# EAGLE design Teeces PSI (EAGLE 9.5.1)
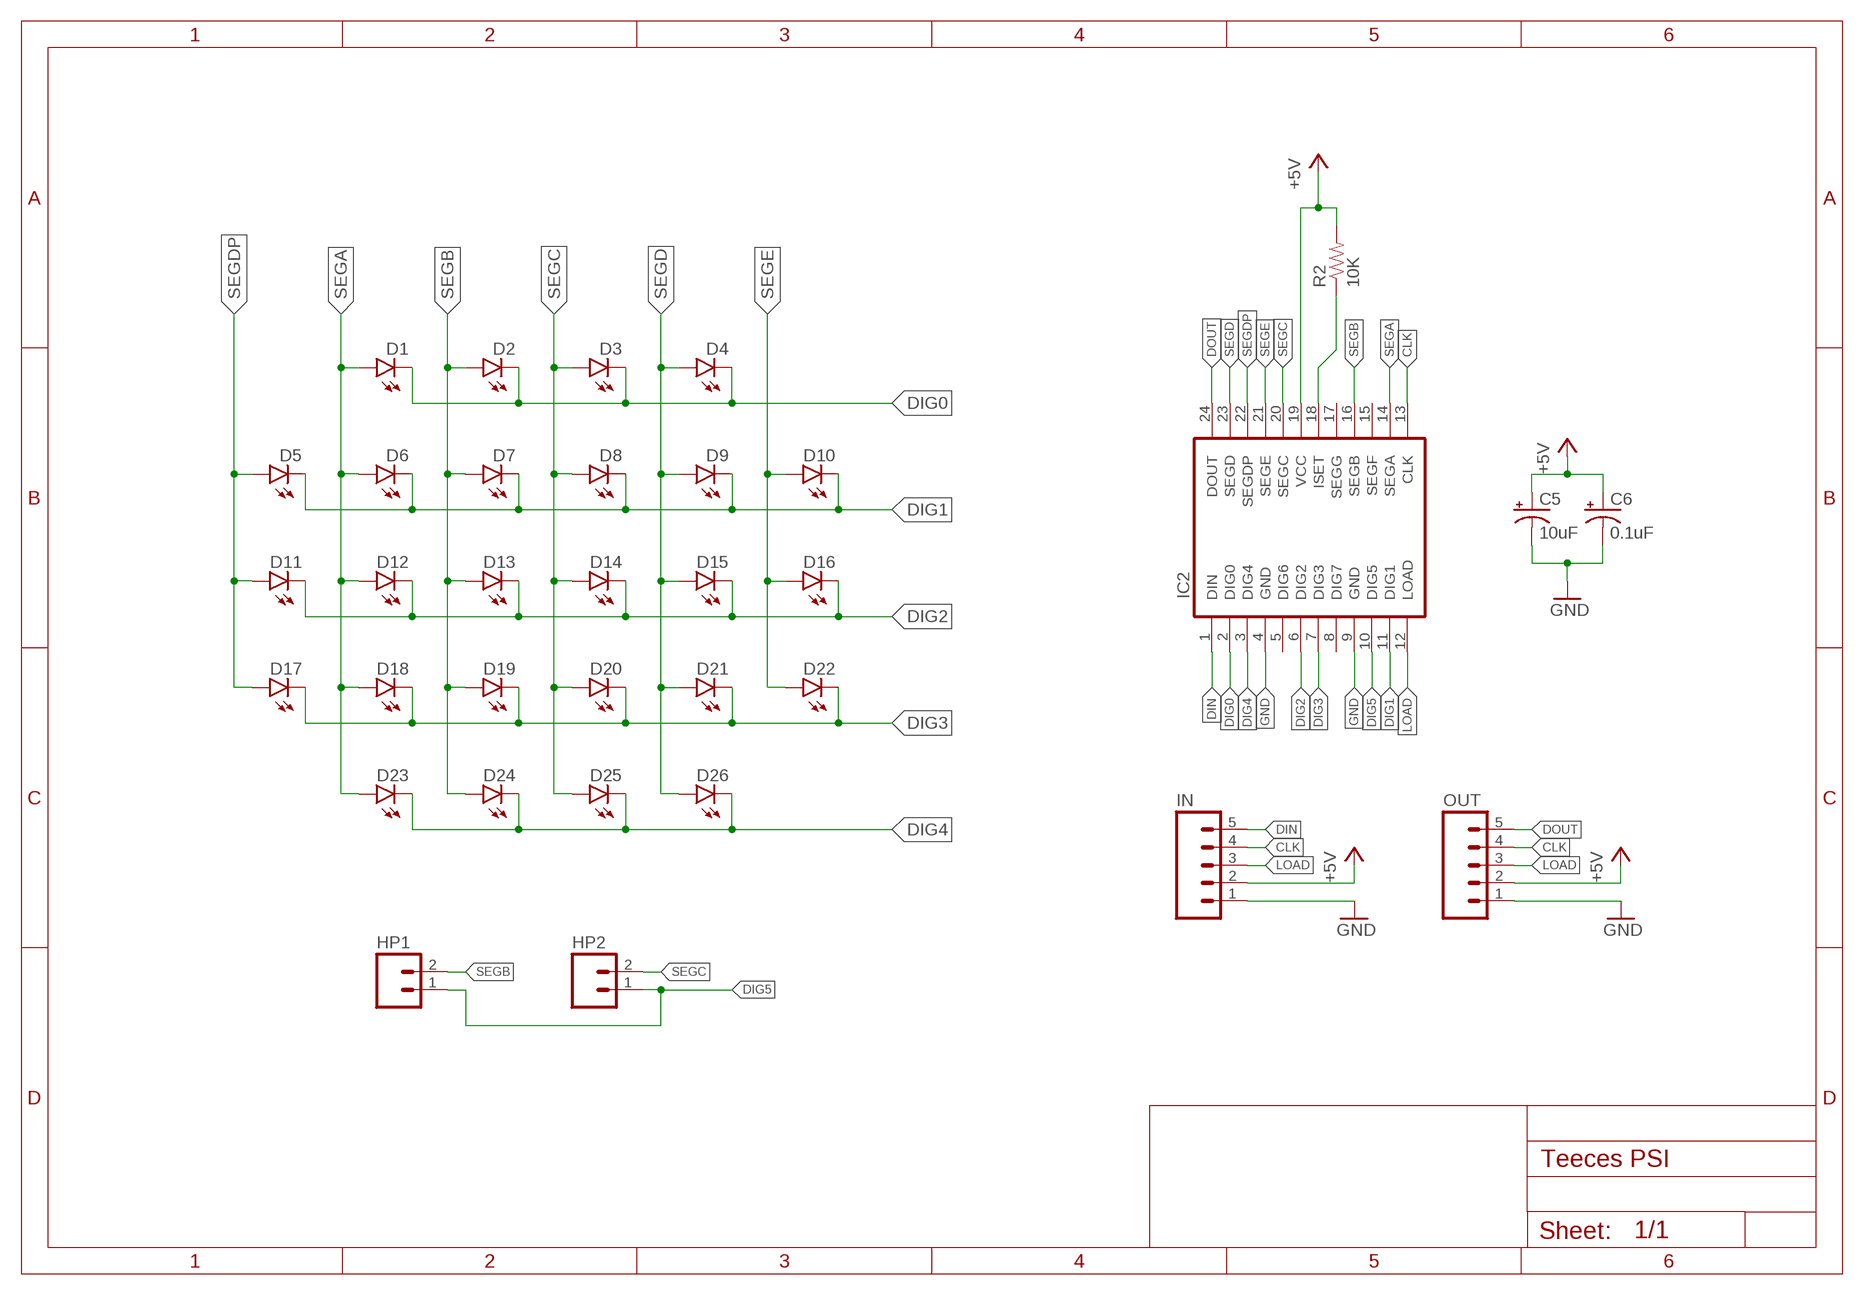
[diagram p0: schematic, sheet 1]

## Parts
C5  10uF  CPOL-USE2.5-5  [E2,5-5]
C6  0.1uF  CPOL-USE2.5-5  [E2,5-5]
D1  LED5MM  [LED5MM_SLIM]
D2  LED5MM  [LED5MM_SLIM]
D3  LED5MM  [LED5MM_SLIM]
D4  LED5MM  [LED5MM_SLIM]
D5  LED5MM  [LED5MM_SLIM]
D6  LED5MM  [LED5MM_SLIM]
D7  LED5MM  [LED5MM_SLIM]
D8  LED5MM  [LED5MM_SLIM]
D9  LED5MM  [LED5MM_SLIM]
D10  LED5MM  [LED5MM_SLIM]
D11  LED5MM  [LED5MM_SLIM]
D12  LED5MM  [LED5MM_SLIM]
D13  LED5MM  [LED5MM_SLIM]
D14  LED5MM  [LED5MM_SLIM]
D15  LED5MM  [LED5MM_SLIM]
D16  LED5MM  [LED5MM_SLIM]
D17  LED5MM  [LED5MM_SLIM]
D18  LED5MM  [LED5MM_SLIM]
D19  LED5MM  [LED5MM_SLIM]
D20  LED5MM  [LED5MM_SLIM]
D21  LED5MM  [LED5MM_SLIM]
D22  LED5MM  [LED5MM_SLIM]
D23  LED5MM  [LED5MM_SLIM]
D24  LED5MM  [LED5MM_SLIM]
D25  LED5MM  [LED5MM_SLIM]
D26  LED5MM  [LED5MM_SLIM]
HP1  M02SQ  [1X02-SQ]
HP2  M02SQ  [1X02-SQ]
IC2  MAX7219CNG  MAX7219CNGROUNDPADS  [DIP24-3]
IN  CONN_05  [1X05]
OUT  CONN_05  [1X05]
R2  10K  RESISTORAXIAL-0.3  [AXIAL-0.3]

## Nets
+5V [power]: C5.+ C6.+ IC2.19(VCC) IN.2 OUT.2 R2.P$2
CLK: IC2.13(CLK) IN.4 OUT.4
DIG0: D1.K(C) D2.K(C) D3.K(C) D4.K(C) IC2.2(DIG0)
DIG1: D5.K(C) D6.K(C) D7.K(C) D8.K(C) D9.K(C) D10.K(C) IC2.11(DIG1)
DIG2: D11.K(C) D12.K(C) D13.K(C) D14.K(C) D15.K(C) D16.K(C) IC2.6(DIG2)
DIG3: D17.K(C) D18.K(C) D19.K(C) D20.K(C) D21.K(C) D22.K(C) IC2.7(DIG3)
DIG4: D23.K(C) D24.K(C) D25.K(C) D26.K(C) IC2.3(DIG4)
DIG5: HP1.1 HP2.1 IC2.10(DIG5)
DIN: IC2.1(DIN) IN.5
DOUT: IC2.24(DOUT) OUT.5
GND [power]: C5.- C6.- IC2.4(GND) IC2.9(GND) IN.1 OUT.1
LOAD: IC2.12(LOAD) IN.3 OUT.3
N$19: IC2.18(ISET) R2.P$1
SEGA: D1.A D6.A D12.A D18.A D23.A IC2.14(SEGA)
SEGB: D2.A D7.A D13.A D19.A D24.A HP1.2 IC2.16(SEGB)
SEGC: D3.A D8.A D14.A D20.A D25.A HP2.2 IC2.20(SEGC)
SEGD: D4.A D9.A D15.A D21.A D26.A IC2.23(SEGD)
SEGDP: D5.A D11.A D17.A IC2.22(SEGDP)
SEGE: D10.A D16.A D22.A IC2.21(SEGE)
Unconnected: IC2.5(DIG6) IC2.8(DIG7) IC2.15(SEGF) IC2.17(SEGG)

## Library data of the parts
C5 C6 = rseries:CPOL-US: POLARIZED CAPACITOR, American symbol
D1-D26 = rseries:LED: LEDs Thru-hole 3mm and 5mm LEDs used on Teeces logic displays
HP1 HP2 = rseries:M02: Standard 2-pin 0.1" header. Use with - straight break away headers ( PRT-00116) - right angle break away headers (PRT-00553) - swiss pins (PRT-00743) - machine pins (PRT-00117) - female headers (PRT-00115) Molex polarized connector foot print use with: PRT-08233 with associated crimp pins and housings. 2.54_SCREWTERM for use with PRT-10571. 3.5mm Screw Terminal footprints for PRT-08084 5mm Screw Terminal footprints for use with PRT-08432
IC2 = rseries:MAX7219CNG: LED DISPLAY DRIVER
IN OUT = rseries:CONN_05: Multi connection point. Often used as Generic Header-pin footprint for 0.1 inch spaced/style header connections On any of the 0.1 inch spaced packages, you can populate with these: Break Away Headers - Straight <https://www.sparkfun.com/products/116> (PRT-00116) Break Away Male Headers - Right Angle <https://www.sparkfun.com/products/553> (PRT-00553) Female Headers <https://www.sparkfun.com/products/115> (PRT-00115) Break Away Headers - Machine Pin <https://www.sparkfun.com/products/117> (PRT-00117) Break Away Female Headers - Swiss Machine Pin <https://www.sparkfun.com/products/743> (PRT-00743) For SCREWTERMINALS and SPRING TERMINALS visit here: Screw Terimnals on SparkFun.com <https://www.sparkfun.com/search/results?term=Screw+Terminals> (5mm/3.5mm/2.54mm spacing) This device is also useful as a general connection point to wire up your design to another part of your project. Our various solder wires solder well into these plated through hole pads. Hook-Up Wire - Assortment (Stranded, 22 AWG) <https://www.sparkfun.com/products/11375> (PRT-11375) Hook-Up Wire - Assortment (Solid Core, 22 AWG) <https://www.sparkfun.com/products/11367> (PRT-11367) View the entire wire category on our website here <https://www.sparkfun.com/categories/141> Special notes: Molex polarized connector foot print use with SKU : PRT-08231 with associated crimp pins and housings. 1MM SMD Version SKU: PRT-10208
R2 = SparkFun-Resistors:RESISTOR: Resistor Basic schematic elements and footprints for 0603, 1206, and PTH resistors.

## Net classes
0 default: width 0.254 mm, drill 0.254 mm, clearance 0.076 mm
1 power: width 0.508 mm, clearance 0.076 mm

## Board
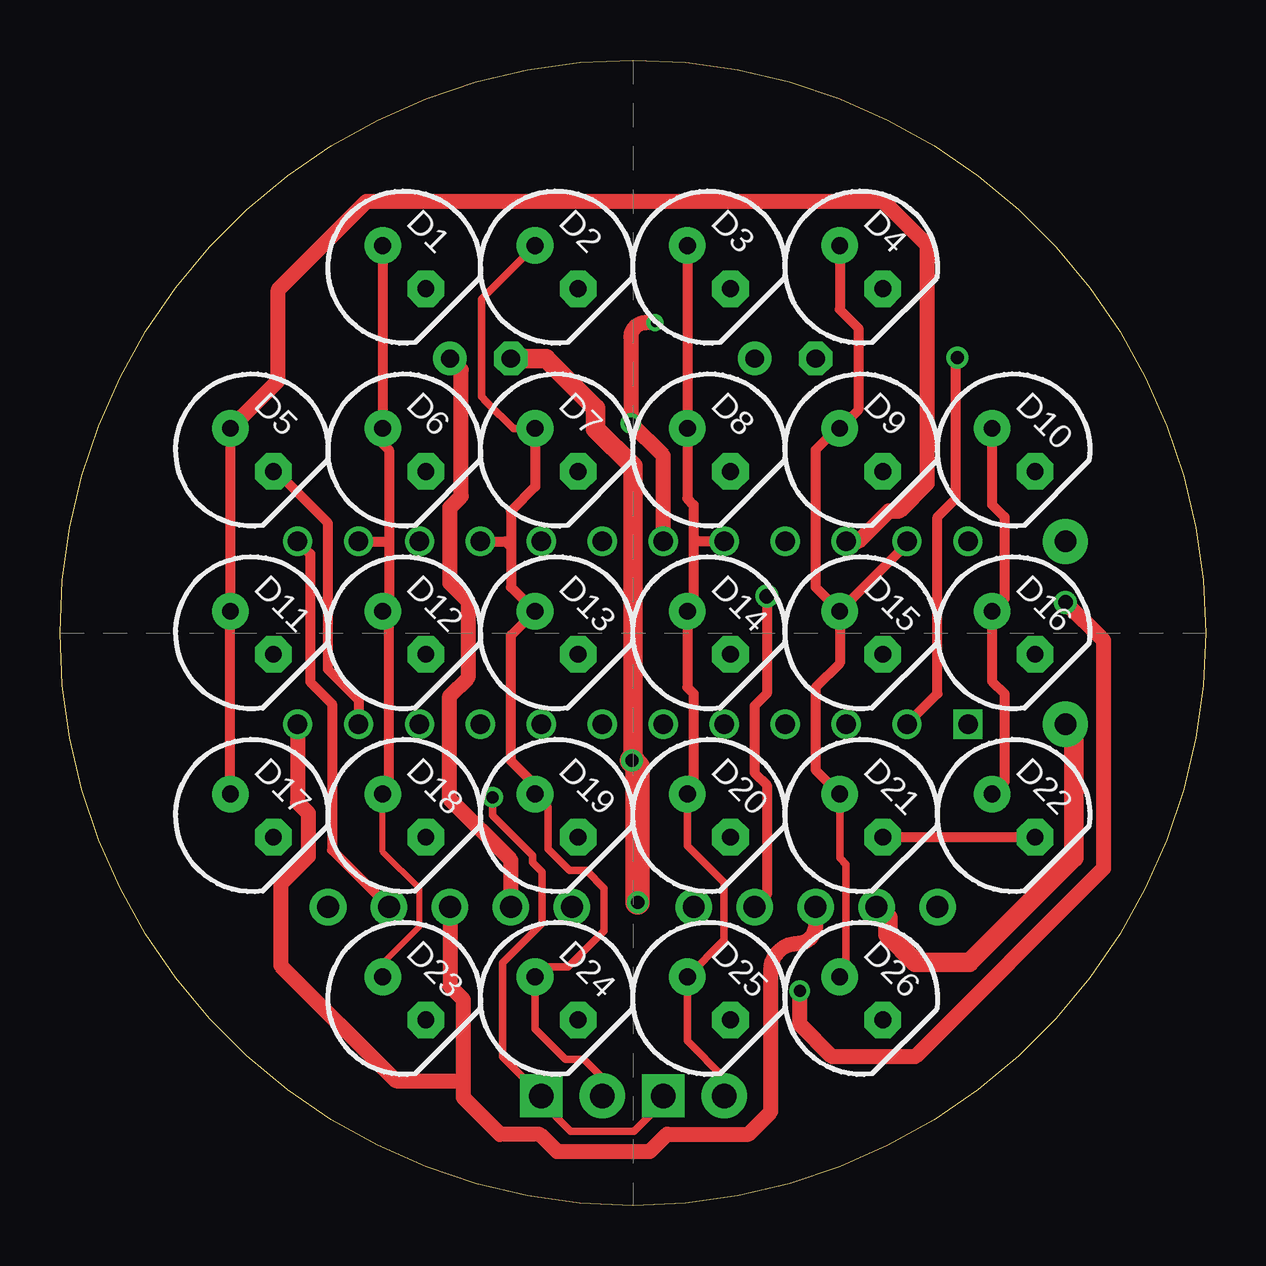
[diagram p1: board, top side]
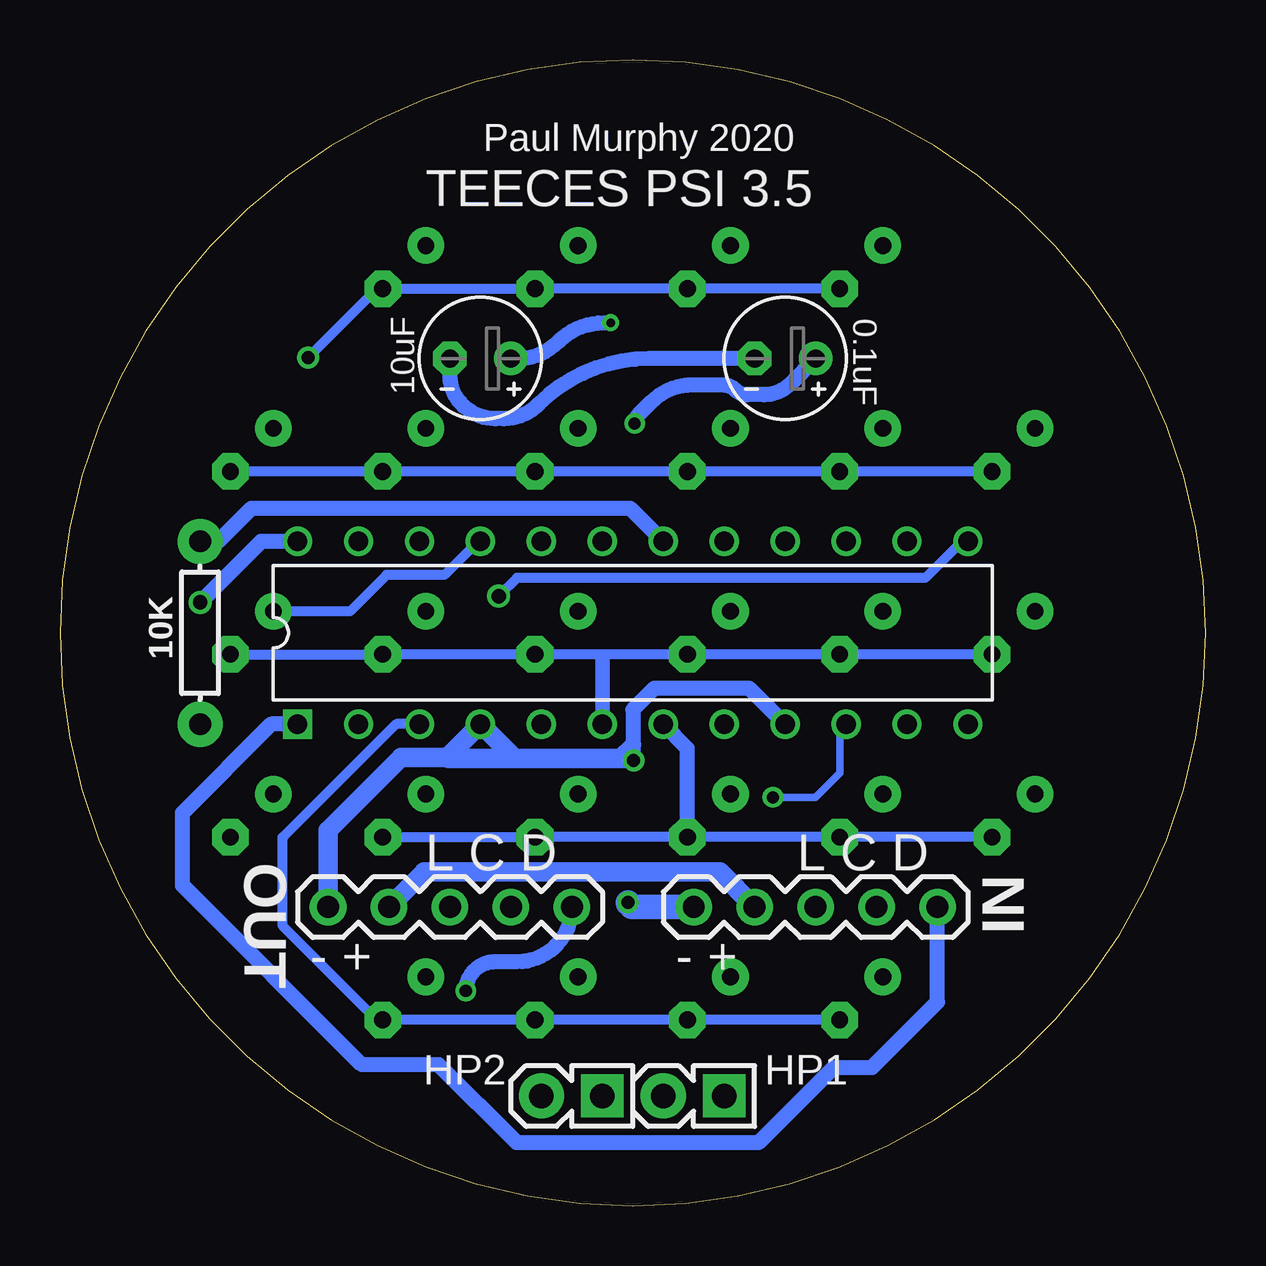
[diagram p2: board, bottom side, seen from below]

Size 47.75 x 47.75 mm. Coordinates in mm from the lower left corner, seen from the top.
Outline: 23.88,0 arc-90 0,23.88 arc-90 23.88,47.75 arc-90 47.75,23.88 arc-90 23.88,0
Copper layers (1*16): Top 0.0356mm / dielectric 1.5011mm / Bottom 0.0356mm
Design rules "LaenPCBOrder *": minimum track width 8mil, minimum drill 13mil, track to track 11mil, track to pad 11mil, pad to pad 6mil, via to via 6mil, smd to smd 6mil, copper to edge 15mil, drill to drill 6mil, minimum pad ring 7mil, minimum via ring 7mil, stop-mask expansion 3mil, vias tented up to drill 25mil, thermal gap 10mil

### Footprints (pad centres in the part's own frame; a part is rotated, then mirrored left to right if it is on the bottom)
E2,5-5 = drill 0.762 pad 1.397: + -1.27,0 | drill 0.762 pad 1.397 octagon: - 1.27,0
LED5MM_SLIM = drill 0.7 pad 1.524: A -1.27,0 | drill 0.7 pad 1.524 octagon: K 1.27,0
1X02-SQ = drill 1.016 pad 1.778 square: 1 0,0 | drill 1.016 pad 1.88: 2 2.54,0
DIP24-3 = drill 0.813 square: 1 -13.97,-3.81 | drill 0.813: 2 -11.43,-3.81; 3 -8.89,-3.81; 4 -6.35,-3.81; 5 -3.81,-3.81; 6 -1.27,-3.81; 7 1.27,-3.81; 8 3.81,-3.81; 9 6.35,-3.81; 10 8.89,-3.81; 11 11.43,-3.81; 12 13.97,-3.81; 13 13.97,3.81; 14 11.43,3.81; 15 8.89,3.81; 16 6.35,3.81; 17 3.81,3.81; 18 1.27,3.81; 19 -1.27,3.81; 20 -3.81,3.81; 21 -6.35,3.81; 22 -8.89,3.81; 23 -11.43,3.81; 24 -13.97,3.81
1X05 = drill 0.914 pad 1.524: 1 0,0; 2 2.54,0; 3 5.08,0; 4 7.62,0; 5 10.16,0
AXIAL-0.3 = drill 0.9 pad 1.88: P$1 -3.81,0; P$2 3.81,0

### Placement (x,y rotation side)
C5  30.23,35.31 180 bottom
C6  17.53,35.31 180 bottom
D1  14.35,39.12 315 top
D2  20.7,39.12 315 top
D3  27.05,39.12 315 top
D4  33.4,39.12 315 top
D5  8,31.5 315 top
D6  14.35,31.5 315 top
D7  20.7,31.5 315 top
D8  27.05,31.5 315 top
D9  33.4,31.5 315 top
D10  39.75,31.5 315 top
D11  8,23.88 315 top
D12  14.35,23.88 315 top
D13  20.7,23.88 315 top
D14  27.05,23.88 315 top
D15  33.4,23.88 315 top
D16  39.75,23.88 315 top
D17  8,16.26 315 top
D18  14.35,16.26 315 top
D19  20.7,16.26 315 top
D20  27.05,16.26 315 top
D21  33.4,16.26 315 top
D22  39.75,16.26 315 top
D23  14.35,8.64 315 top
D24  20.7,8.64 315 top
D25  27.05,8.64 315 top
D26  33.4,8.64 315 top
HP1  20.07,4.57 180 bottom
HP2  25.15,4.57 180 bottom
IC2  23.88,23.88 0 bottom
IN  21.34,12.45 0 bottom
OUT  36.58,12.45 0 bottom
R2  41.91,23.88 270 bottom

### Tracks (layer width: path | path; a pad name or v marks a point on that pad's centre or on a via)
+5V  (via drill 0.35 pad 0.65, 0.5)
  Top 0.635: v24.8,36.8 24.4,36.8 arc90 23.8,36.2 v23.8,32.6 25.15,31.25 IC2.19 | IN.2 18.8,14.4 16.24,16.96 16.24,21.24 17,22 17,25.2 16.26,25.94 16.26,29.1 16.72,29.56 16.72,34.84 C6.+
  Top 0.813: OUT.2 34.5,11.98 34.5,11.3 35.66,10.14 37.9,10.14 42.26,14.5 42.26,19.72 R2.P$2
  Bottom 0.635: C6.+ 17.31,34.25 arc45 18.4,33.8 19.12,33.8 arc45 19.6,34 arc-45 20.08,34.2 21.4,34.2 arc-45 23.11,33.49 23.66,32.94 arc-45 v23.8,32.6 | C5.+ 28.68,35.31 arc-45 27,36 arc45 25.07,36.8 v24.8,36.8
  Bottom 0.813: OUT.2 32.58,13.9 20.25,13.9 IN.2
CLK  (via drill 0.6)
  Top 0.406: v29.46,25.4 29.46,21.34 28.96,20.83 28.96,18.03 29.46,17.53 29.46,12.95 OUT.4 | IC2.13 10.43,27.16 10.43,21.83 11.34,20.92 11.34,14.82 IN.4
  Bottom 0.406: IC2.13 10.16,27.69 11.68,26.16 28.7,26.16 v29.46,25.4
DIG0  (via drill 0.55)
  Top 0.406: IC2.2 36.58,21.34 36.58,28.7 37.34,29.46 37.34,35.27 v37.41,35.34
  Bottom 0.406: D1.K D2.K D3.K D4.K 34.53,38.22 v37.41,35.34
DIG1
  Top 0.406: D5.K 9.03,30.6 11.18,28.45 11.18,22.35 12.45,21.08 IC2.11
  Bottom 0.406: D5.K D6.K D7.K D8.K D9.K D10.K
DIG2
  Bottom 0.406: D11.K D12.K D13.K 24.98,22.98 | 24.98,22.98 D14.K D15.K D16.K | 25.15,22.81 24.98,22.98
  Bottom 0.61: IC2.6 25.15,22.81
DIG3
  Top 0.406: D21.K D22.K
  Bottom 0.406: D17.K D18.K D19.K D20.K D21.K
  Bottom 0.635: D19.K 21.6,19.06 IC2.7
DIG4
  Bottom 0.406: D23.K D24.K D25.K D26.K 34.55,7.74 38.49,11.68 38.49,15.36 38.44,15.36 33.73,20.07 IC2.3
DIG5  (via drill 0.51)
  Top 0.305: HP2.1 25.15,4.32 23.92,3.09 21.29,3.09 20.07,4.32 HP1.1 18.44,6.19 18.44,10.11 20.1,11.77 20.1,13.9 19.7,14.3 19.7,14.6 18.03,16.27 v18.03,17.02
  Bottom 0.305: v18.03,17.02 16.26,17.02 15.24,18.03 15.24,19.81 IC2.10
DIN
  Bottom 0.635: IC2.1 38.95,20.07 42.64,16.38 42.64,13.34 35.17,5.87 31.97,5.87 28.73,2.63 18.62,2.63 15.49,5.76 13.9,5.76 11.18,8.48 IN.5
DOUT  (via drill 0.51, 0.6)
  Top 0.635: v41.91,25.15 43.49,23.57 43.49,14.05 35.65,6.21 32.18,6.21 30.84,7.55 v30.84,8.95
  Bottom 0.635: OUT.5 arc90 28.7,10.16 29.62,10.16 arc-90 v30.84,8.95 | IC2.24 39.37,27.69 v41.91,25.15
GND  (via drill 0.55 pad 0.65)
  Top 0.813: C6.- 20.26,35.31 22.33,33.24 22.33,32.36 23.88,30.82 23.88,18.51 24.08,18.31
  Top 1.016: v23.84,18.55 24.08,18.31 v24.08,12.64
  Bottom 0.635: C6.- 23.2,35.31 arc-45 27.8,33.4 arc45 29.25,32.8 29.6,32.8 arc45 30.97,33.37 31,33.4 arc45 31.5,34.6 C5.- | IC2.9 19.02,21.56 22.98,21.56 23.87,20.67 23.87,19.25 | 23.87,19.25 24.49,18.63 | 23.94,12.45 24.08,12.59 | 23.87,19.25 23.84,19.22 v23.84,18.55 23.92,18.63
  Bottom 0.813: 28.79,18.63 IC2.4 31.61,18.68 | 28.79,18.63 24.49,18.63 23.92,18.63 | 31.61,18.68 33.53,18.68 36.58,15.63 OUT.1 | 28.79,18.63 31.56,18.63 31.61,18.68
  Bottom 1.016: IN.1 23.94,12.45 | 24.08,12.59 v24.08,12.64
LOAD
  Top 0.635: IN.3 16.26,9.14 16.82,8.59 16.82,5.2 | OUT.3 31.5,11.68 arc-90 30.73,10.92 arc90 29.63,9.82 29.63,3.91 28.7,2.98 25.31,2.98 24.59,2.26 20.71,2.26 20,2.97 18.34,2.97 16.82,4.5 16.82,5.2 | IC2.12 9.91,16.8 10.35,16.36 10.35,14.55 9.2,13.4 9.2,10 14,5.2 16.82,5.2
N$19
  Bottom 0.635: IC2.18 23.98,29.06 39.78,29.06 41.15,27.69 R2.P$1
SEGA
  Top 0.254: D23.A 13.45,10.1 14.99,11.64 14.99,13.22 13.45,14.75 D18.A
  Top 0.406: 13.72,27.69 13.72,31.5 13.45,31.76 D6.A D1.A | 13.72,27.69 13.72,25.04 D12.A 13.69,24.53 13.69,17.39 D18.A | IC2.14 13.72,27.69
SEGB
  Top 0.305: HP1.2 22.61,5.33 21.84,6.1 21.08,6.1 19.8,7.38 D24.A 19.8,9.59 20.17,9.96 21.18,9.96 22.69,11.46 22.69,13.23 21.95,13.97 21.24,13.97 20.34,14.87 20.34,16.61 D19.A | D7.A 18.9,32.39 17.79,33.5 17.56,33.73 17.56,37.77 D2.A
  Top 0.406: D7.A 19.8,29.96 18.8,28.96 18.8,27.46 | 18.8,27.46 18.8,25.78 D13.A 18.8,23.77 18.8,18.54 19.8,17.54 D19.A | IC2.16 18.57,27.69 18.8,27.46
SEGC
  Top 0.305: D20.A 26.15,14.99 27.69,13.46 27.69,11.07 D25.A 26.15,6.87 27.69,5.33 HP2.2
  Top 0.406: D20.A 26.42,17.42 26.42,21.34 26.15,21.6 D14.A 26.42,25.04 26.42,27.86 | 26.42,27.86 26.42,29.21 26.15,29.47 D8.A D3.A | IC2.20 26.59,27.69 26.42,27.86
SEGD
  Top 0.305: D21.A 32.5,14.49 32.77,14.22 32.77,9.8 D26.A
  Top 0.406: D15.A 31.5,25.78 31.5,31.5 32.39,32.39 D9.A 33.27,33.16 33.27,36.58 32.5,37.35 D4.A | D15.A 32.5,22.6 31.5,21.59 31.5,18.16 D21.A | IC2.23 35.31,27.58 D15.A
SEGDP
  Top 0.406: D17.A D11.A D5.A
  Top 0.635: D5.A 9.1,34.39 9.1,38.19 12.77,41.86 34.33,41.86 36.14,40.05 36.14,30.09 35.01,28.96 34.54,28.96 33.27,27.69 IC2.22
SEGE
  Top 0.406: D10.A 38.85,29.22 39.37,28.7 39.37,25.29 D16.A 38.85,21.85 39.37,21.34 39.37,17.67 D22.A
  Bottom 0.406: IC2.21 30.33,27.69 31.73,26.29 34.14,26.29 35.66,24.77 D16.A

### Text on the board
bPlace: Paul Murphy 2020 | TEECES PSI 3.5 | L C D | L C D | - + | - +